# EasyEDA Pro project ProPrj_KrabbyUno - v0.2_2026-05-19.epro, board PCB2
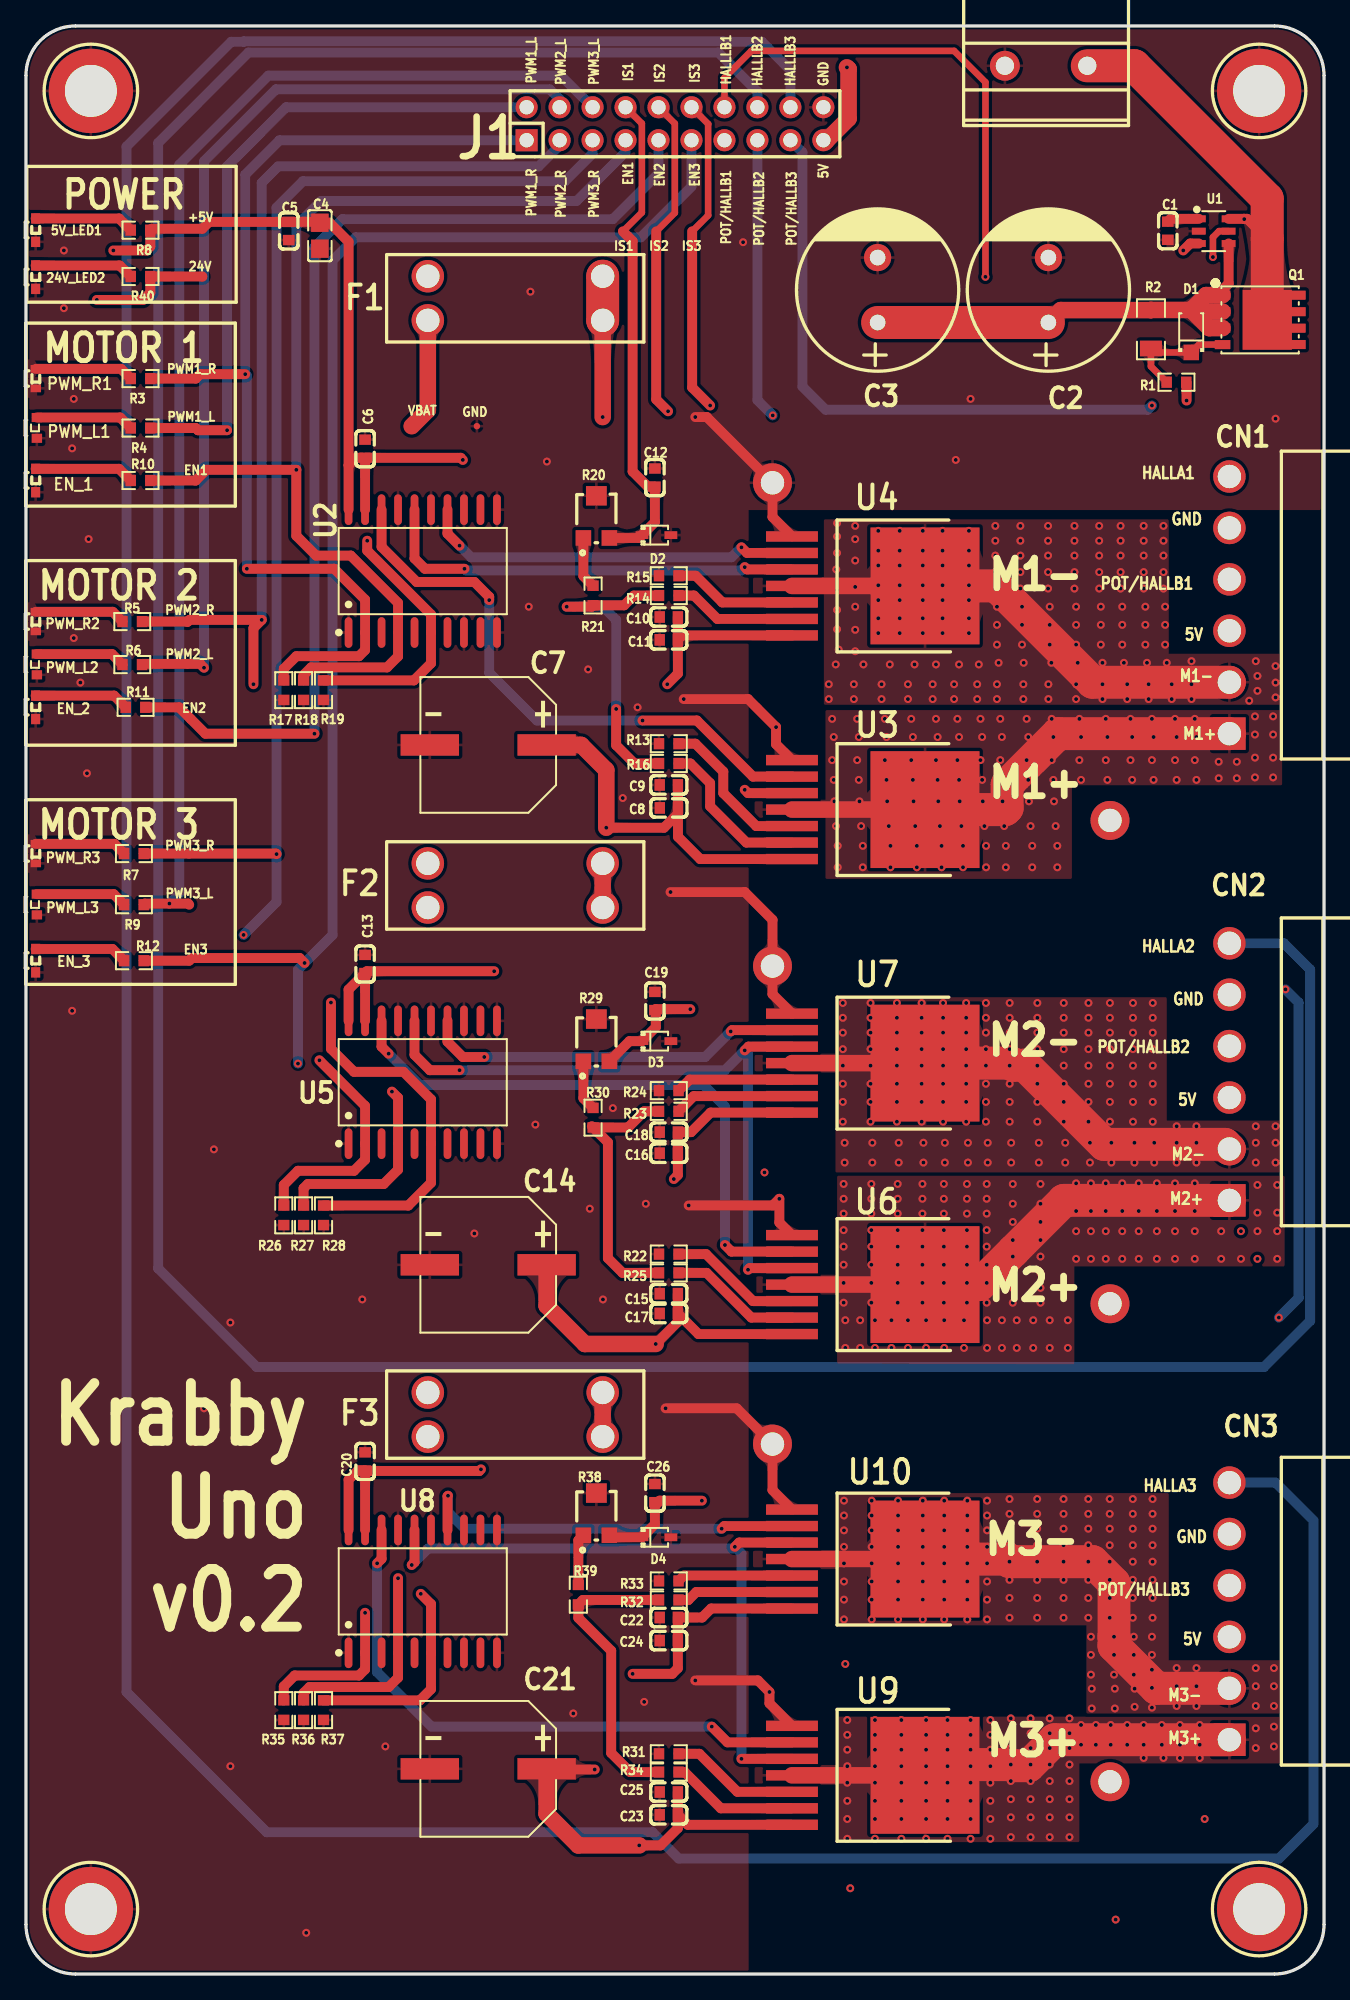
[diagram p8: board, top side]
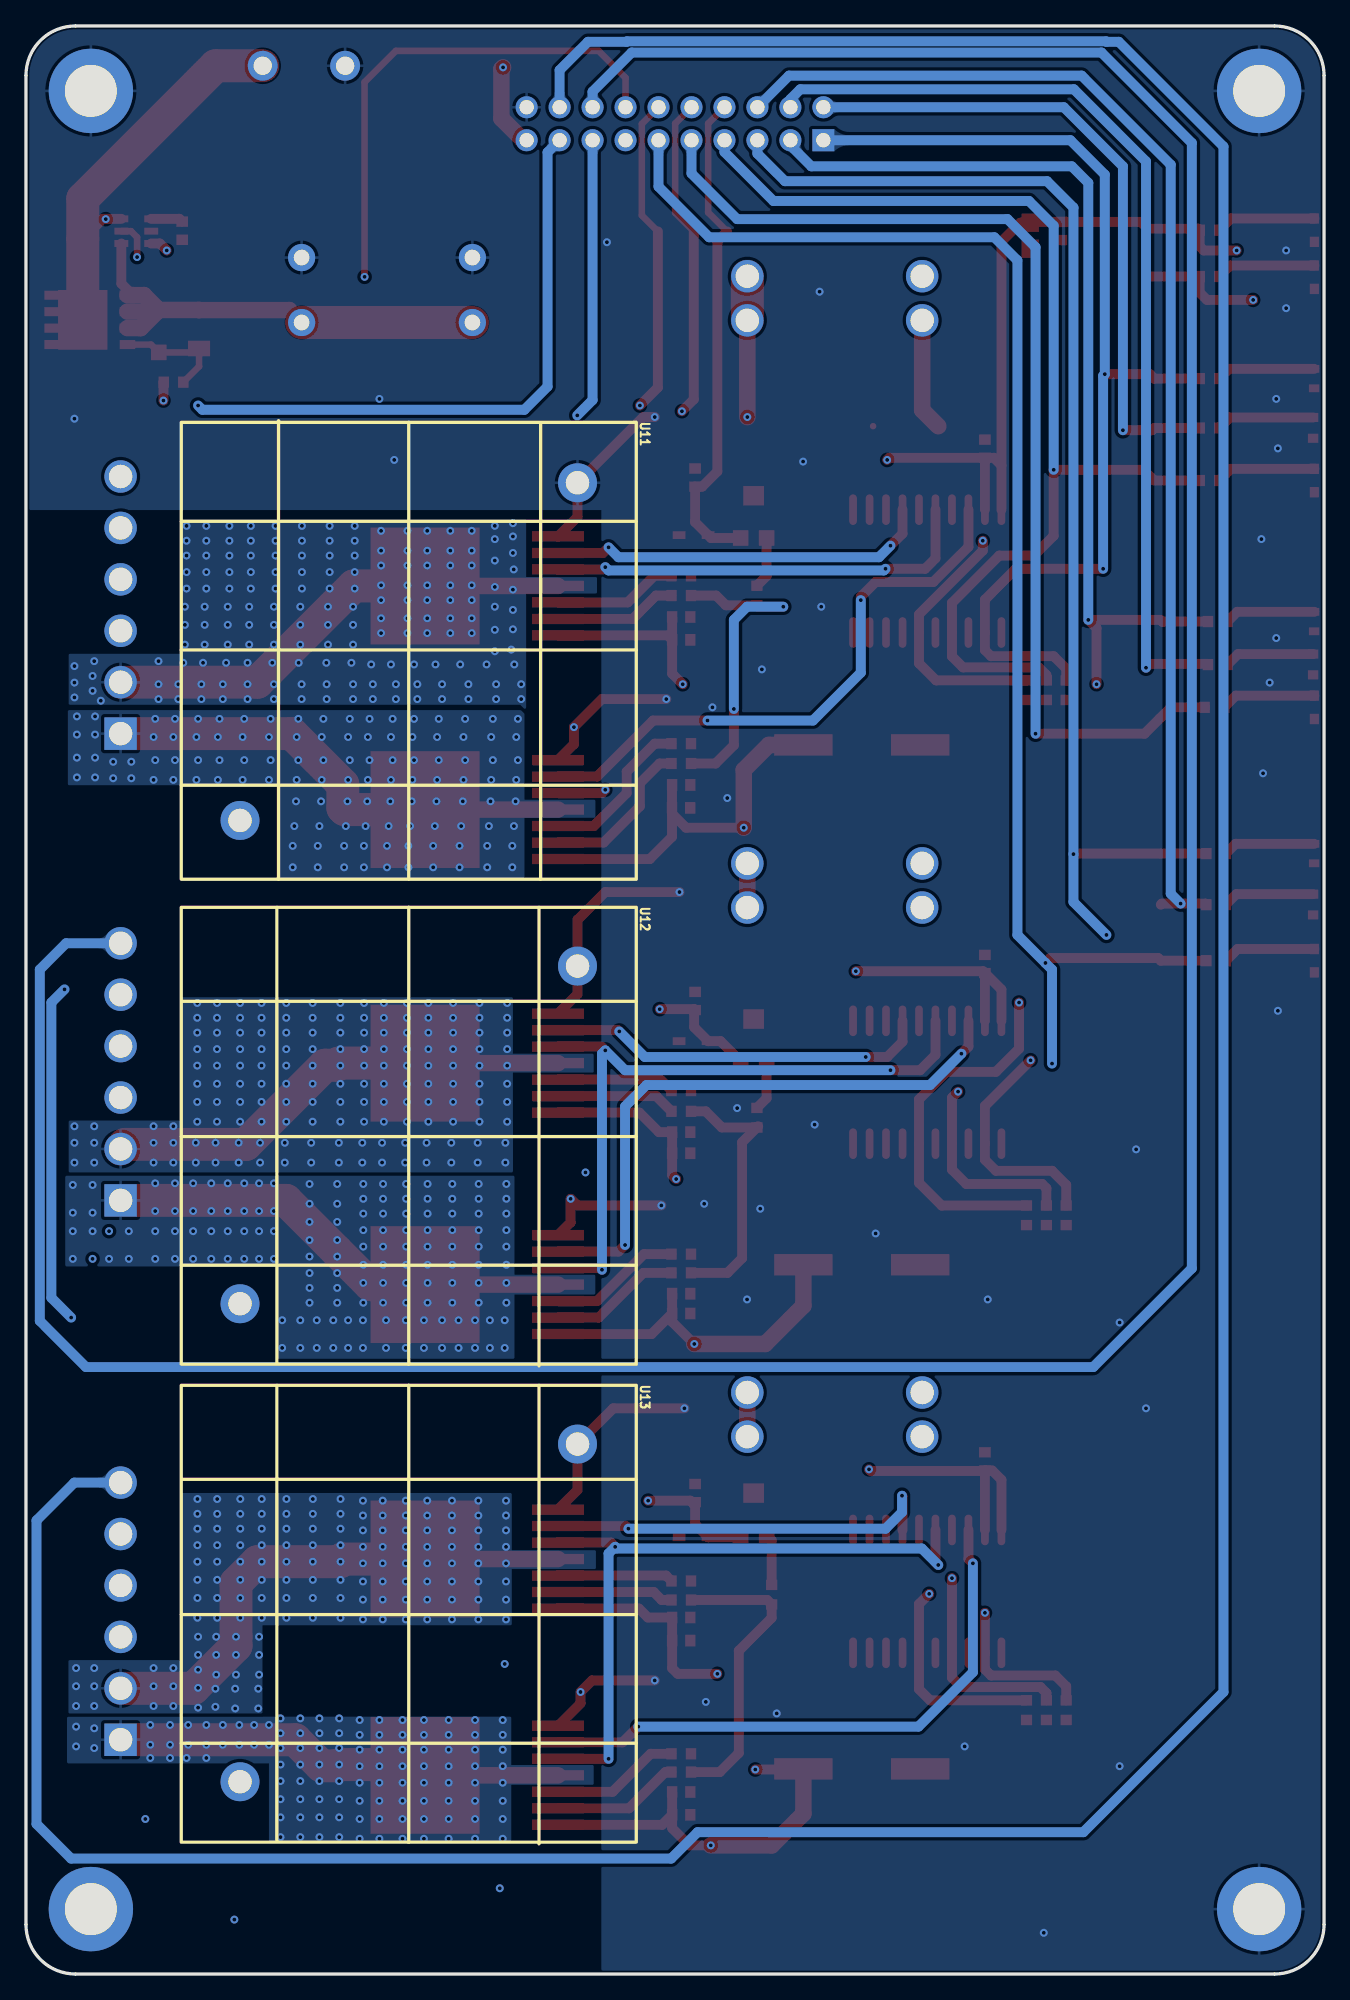
[diagram p9: board, bottom side, seen from below]

Outline 100 x 150 mm; copper layers: Top Layer, Inner1, Inner2, Bottom Layer. Coordinates in mm from the lower left corner of the outline.
Outline path: 0,146.19 0,3.81 arc(1.12,1.12) 3.81,0 96.19,0 arc(98.88,1.12) 100,3.81 100,146.19 arc(98.88,148.88) 96.19,150 3.81,150 arc(1.12,148.88) 0,146.19
Stack: Top Layer 0.035mm Outer layer thickness 1oz / Dielectric1 0.2104mm 7628 RC49% 8.6mil / Inner1 0.0152mm Inner layer thickness / Dielectric2 1.065mm 1.1mm H/HOZ Copper / Inner2 0.0152mm Inner layer thickness / Dielectric3 0.2104mm 7628 RC49% 8.6mil / Bottom Layer 0.035mm Outer layer thickness 1oz

## Design rules (mm)
template: Custom Config
spacing copperThickness1oz (default): track to track 0.102, other pairs 0.152 to 0.3
spacing copperThickness2oz: track to track 0.203, other pairs 0.152 to 0.3
track width copperThickness1oz (default): min 0.127, default 0.762, max 3.81
track width copperThickness2oz: min 0.203, default 0.254, max 2.54
differential pair differentialPair (default): width min 0.127, default 0.254, max 2.54; gap min 0.152, default 0.152
via viaSize (default): diameter min 0.5, default 0.61, max 10; hole min 0.3, default 0.305, max 6.3

## Placement (name value [footprint] x y rotation side)
5V_LED1  LTST-S270TGKT  [LED-SMD_L1.7-W0.6-RD_GREEN]  0.75 134.28 90 top
24V  -  [Test-Point-0.5mm]  13.59 130.7 0 top
24V_LED2  LTST-S270TGKT  [LED-SMD_L1.7-W0.6-RD_GREEN]  0.75 130.66 90 top
+5V  -  [Test-Point-0.5mm]  13.59 134.39 270 top
C1  100nF  [C0603]  87.97 134.24 90 top
C2  1000uF  [CAP-TH_BD12.5-P5.00-D0.6-FD]  78.77 129.67 90 top
C3  1000uF  [CAP-TH_BD12.5-P5.00-D0.6-FD]  65.61 129.67 90 top
C4  4.7uF  [C0805]  22.64 133.85 90 top
C5  100nF  [C0603]  20.24 134.21 270 top
C6  100nF  [C0603]  26.12 117.45 270 top
C7  330uF  [CAP-SMD_BD10.0-L10.3-W10.3-LS11.0-FD]  35.61 94.64 180 top
C8  100nF  [C0603]  49.53 89.79 180 top
C9  1uF  [C0603]  49.52 91.56 180 top
C10  100nF  [C0603]  49.52 104.49 180 top
C11  1uF  [C0603]  49.52 102.73 180 top
C12  100nF  [C0603]  48.45 115.23 90 top
C13  100nF  [C0603]  26.12 77.78 270 top
C14  330uF  [CAP-SMD_BD10.0-L10.3-W10.3-LS11.0-FD]  35.61 54.61 180 top
C15  100nF  [C0603]  49.52 52.39 180 top
C16  1uF  [C0603]  49.52 63.2 180 top
C17  100nF  [C0603]  49.52 50.86 180 top
C18  1uF  [C0603]  49.52 64.83 180 top
C19  100nF  [C0603]  48.45 74.92 90 top
C20  100nF  [C0603]  26.12 39.47 270 top
C21  330uF  [CAP-SMD_BD10.0-L10.3-W10.3-LS11.0-FD]  35.61 15.8 180 top
C22  100nF  [C0603]  49.52 27.45 180 top
C23  1uF  [C0603]  49.52 12.26 180 top
C24  100nF  [C0603]  49.52 25.68 180 top
C25  1uF  [C0603]  49.52 14.02 180 top
C26  100nF  [C0603]  48.45 37.03 90 top
CN1  B6PS-VH(LF)(SN)  [CONN-TH_B6PS-VH-LF-SN]  92.71 105.41 90 top
CN2  B6PS-VH(LF)(SN)  [CONN-TH_B6PS-VH-LF-SN]  92.71 69.47 90 top
CN3  B6PS-VH(LF)(SN)  [CONN-TH_B6PS-VH-LF-SN]  92.71 27.94 90 top
D1  KDZVTR12B  [SOD-123FL_L2.7-W1.8-LS3.8-RD]  89.77 126.5 90 top
D2  BZT52C5V1S  [SOD-323_L1.7-W1.3-LS2.5-RD-1]  48.56 110.8 0 top
D3  BZT52C5V1S  [SOD-323_L1.7-W1.3-LS2.5-RD-1]  48.56 71.83 0 top
D4  BZT52C5V1S  [SOD-323_L1.7-W1.3-LS2.5-RD-1]  48.56 33.63 0 top
EN1  -  [Test-Point-0.5mm]  13.08 115 0 top
EN2  -  [Test-Point-0.5mm]  12.7 96.63 0 top
EN3  -  [Test-Point-0.5mm]  12.57 78.03 0 top
EN_1  LTST-S270TGKT  [LED-SMD_L1.7-W0.6-RD_GREEN]  0.75 115 90 top
EN_2  LTST-S270TGKT  [LED-SMD_L1.7-W0.6-RD_GREEN]  0.75 97.54 90 top
EN_3  LTST-S270TGKT  [LED-SMD_L1.7-W0.6-RD_GREEN]  0.75 78.03 90 top
F1  3557-2  [FUSE-TH_4P-L19.8-W6.7_3557-2]  37.69 129.03 0 top
F2  3557-2  [FUSE-TH_4P-L19.8-W6.7_3557-2]  37.69 83.82 0 top
F3  3557-2  [FUSE-TH_4P-L19.8-W6.7_3557-2]  37.69 43.08 0 top
GND  -  [Test-Point-0.5mm]  34.74 119.18 0 top
IS1  -  [Test-Point-0.5mm]  45.99 134.18 0 top
IS2  -  [Test-Point-0.5mm]  48.55 134.18 270 top
IS3  -  [Test-Point-0.5mm]  51.32 134.18 270 top
J1  PZ254V-12-20P  [HDR-TH_20P-P2.54-V-M-R2-C10-S2.54]  50 142.47 0 top
M1  SMTSO2025CTJ  [SMD-1_BD6.2-D3.6]  5 5 0 top
M1+  -  [Test-Point-0.5mm]  75.59 89.8 0 top
M1-  -  [Test-Point-0.5mm]  75.59 106.05 90 top
M2  SMTSO2025CTJ  [SMD-1_BD6.2-D3.6]  95 5 0 top
M2+  -  [Test-Point-0.5mm]  76.07 55.68 270 top
M2-  -  [Test-Point-0.5mm]  76.07 69.98 180 top
M3  SMTSO2025CTJ  [SMD-1_BD6.2-D3.6]  5 145 0 top
M3+  -  [Test-Point-0.5mm]  75.95 16.03 0 top
M3-  -  [Test-Point-0.5mm]  75.95 31.65 0 top
M4  SMTSO2025CTJ  [SMD-1_BD6.2-D3.6]  95 145 0 top
PWM1_L  -  [Test-Point-0.5mm]  13.08 119.04 0 top
PWM1_R  -  [Test-Point-0.5mm]  13.08 122.85 0 top
PWM2_L  -  [Test-Point-0.5mm]  12.45 100.88 270 top
PWM2_R  -  [Test-Point-0.5mm]  12.45 104.12 0 top
PWM3_L  -  [Test-Point-0.5mm]  12.57 82.34 180 top
PWM3_R  -  [Test-Point-0.5mm]  12.57 86.28 270 top
PWM_L1  XL-1606UBC  [LED-SMD_L1.7-W1.1-R-RD_BULE]  0.84 119.05 90 top
PWM_L2  XL-1606UBC  [LED-SMD_L1.7-W1.1-R-RD_BULE]  0.84 100.84 90 top
PWM_L3  XL-1606UBC  [LED-SMD_L1.7-W1.1-R-RD_BULE]  0.84 82.35 90 top
PWM_R1  XL-1606UYC  [LED-SMD_L1.7-W1.1-RD_27-21]  0.76 122.85 90 top
PWM_R2  XL-1606UYC  [LED-SMD_L1.7-W1.1-RD_27-21]  0.76 104.14 90 top
PWM_R3  XL-1606UYC  [LED-SMD_L1.7-W1.1-RD_27-21]  0.76 86.28 90 top
PWR_IN1  1714955  [CONN-TH_P6.35_1714955]  78.59 146.94 180 top
Q1  CJAC130SN06L  [PDFN-8_L5.8-W5.0-P1.27-LS6.0-BL]  95.08 127.37 270 top
R1  22R  [R0603]  88.63 122.57 180 top
R2  100kΩ  [R1206]  86.66 126.64 270 top
R3  4.7K  [R0603]  8.83 122.85 180 top
R4  4.7K  [R0603]  8.83 119.04 180 top
R5  4.7K  [R0603]  8.19 104.14 180 top
R6  4.7K  [R0603]  8.19 100.83 180 top
R7  4.7K  [R0603]  8.32 86.28 180 top
R8  4.7K  [R0603]  8.83 134.28 180 top
R9  4.7K  [R0603]  8.32 82.34 180 top
R10  4.7K  [R0603]  8.83 115 180 top
R11  4.7K  [R0603]  8.44 97.54 180 top
R12  4.7K  [R0603]  8.32 78.03 180 top
R13  1K  [R0603]  49.52 94.73 180 top
R14  1K  [R0603]  49.52 106.14 0 top
R15  1K  [R0603]  49.52 107.67 0 top
R16  1K  [R0603]  49.52 93.21 0 top
R17  10K  [R0603]  19.86 98.86 90 top
R18  10K  [R0603]  21.39 98.86 90 top
R19  10K  [R0603]  22.92 98.86 90 top
R20  10kΩ  [RES-ADJ-SMD_3P-L3.0-W3.8-P1.75-BR]  43.94 112.2 270 top
R21  4.7K  [R0603]  43.69 106.15 90 top
R22  1K  [R0603]  49.52 55.43 180 top
R23  1K  [R0603]  49.52 66.43 0 top
R24  1K  [R0603]  49.52 68.02 0 top
R25  1K  [R0603]  49.52 53.99 0 top
R26  10K  [R0603]  19.86 58.42 90 top
R27  10K  [R0603]  21.39 58.42 90 top
R28  10K  [R0603]  22.92 58.42 90 top
R29  10kΩ  [RES-ADJ-SMD_3P-L3.0-W3.8-P1.75-BR]  43.94 71.91 270 top
R30  4.7K  [R0603]  43.69 65.94 90 top
R31  1K  [R0603]  49.52 16.96 180 top
R32  1K  [R0603]  49.52 28.8 0 top
R33  1K  [R0603]  49.52 30.27 0 top
R34  1K  [R0603]  49.52 15.55 0 top
R35  10K  [R0603]  19.86 20.32 90 top
R36  10K  [R0603]  21.39 20.32 90 top
R37  10K  [R0603]  22.92 20.32 90 top
R38  10kΩ  [RES-ADJ-SMD_3P-L3.0-W3.8-P1.75-BR]  43.94 35.41 270 top
R39  4.7K  [R0603]  42.55 29.21 90 top
R40  4.7K  [R0603]  8.83 130.71 180 top
U1  LM74700QDBVRQ1  [SOT-23-6_L2.9-W1.6-P0.95-LS2.8-BL]  91.5 134.2 270 top
U2  SN74AHC244DWR  [SOIC-20_L13.0-W7.6-P1.27-LS10.3-BL]  30.57 108.03 0 top
U3  BTN8982TA  [TO-263-7_L10.2-W10.4-P1.27-LS14.4-TL]  64.13 89.66 0 top
U4  BTN8982TA  [TO-263-7_L10.2-W10.4-P1.27-LS14.4-TL]  64.13 106.88 0 top
U5  SN74AHC244DWR  [SOIC-20_L13.0-W7.6-P1.27-LS10.3-BL]  30.57 68.67 0 top
U6  BTN8982TA  [TO-263-7_L10.2-W10.4-P1.27-LS14.4-TL]  64.13 53.09 0 top
U7  BTN8982TA  [TO-263-7_L10.2-W10.4-P1.27-LS14.4-TL]  64.13 70.14 0 top
U8  SN74AHC244DWR  [SOIC-20_L13.0-W7.6-P1.27-LS10.3-BL]  30.57 29.46 0 top
U9  BTN8982TA  [TO-263-7_L10.2-W10.4-P1.27-LS14.4-TL]  64.13 15.3 0 top
U10  BTN8982TA  [TO-263-7_L10.2-W10.4-P1.27-LS14.4-TL]  64.13 31.95 0 top
U11  XSD188-663  [HEATSINK-SMD_XSD188-663]  70.51 101.83 90 bottom
U12  XSD188-663  [HEATSINK-SMD_XSD188-663]  70.51 64.61 270 bottom
U13  XSD188-663  [HEATSINK-SMD_XSD188-663]  70.51 27.81 270 bottom
VBAT  -  [Test-Point-0.5mm]  29.72 119.18 270 top

## Footprints (pads in the part's own frame, mm; a bottom-side part is the same pattern mirrored in y, then rotated)
C0603
  rect 0.8x0.9 smd: 1(-0.7,0) 2(0.7,0)
C0805
  rect 1.41x1.35 smd: 1(-1,0) 2(1,0)
CAP-SMD_BD10.0-L10.3-W10.3-LS11.0-FD
  rect 4.5x1.65 smd: 1(-4.5,0) 2(4.5,0)
CAP-TH_BD12.5-P5.00-D0.6-FD
  round 2.1 hole 1.2: 1(-2.5,0) 2(2.5,0)
CONN-TH_B6PS-VH-LF-SN
  rect 2.5x2.5 hole 1.8: 1(-9.9,0)
  round 2.5 hole 1.8: 2(-5.94,0) 3(-1.98,0) 4(1.98,0) 5(5.94,0) 6(9.9,0)
CONN-TH_P6.35_1714955
  round 2.3 hole 1.4: 1(-3.175,0) 2(3.175,0)
FUSE-TH_4P-L19.8-W6.7_3557-2
  round 2.5 hole 1.8: 1(-6.735,1.7) 2(-6.735,-1.7) 3(6.735,1.7) 4(6.735,-1.7)
HDR-TH_20P-P2.54-V-M-R2-C10-S2.54
  rect 1.7x1.7 hole 1.1: 1(-11.43,-1.27)
  round 1.7 hole 1.1: 2(-11.43,1.27) 3(-8.89,-1.27) 4(-8.89,1.27) 5(-6.35,-1.27) 6(-6.35,1.27) 7(-3.81,-1.27) 8(-3.81,1.27) 9(-1.27,-1.27) 10(-1.27,1.27) 11(1.27,-1.27) 12(1.27,1.27) 13(3.81,-1.27) 14(3.81,1.27) 15(6.35,-1.27) 16(6.35,1.27) 17(8.89,-1.27) 18(8.89,1.27) 19(11.43,-1.27) 20(11.43,1.27)
HEATSINK-SMD_XSD188-663
  round 3 hole 1.8: 1(-13,13) 2(13,-13)
LED-SMD_L1.7-W0.6-RD_GREEN
  rect 0.8x0.7 smd: 1(-0.9,0) 2(0.9,0)
LED-SMD_L1.7-W1.1-R-RD_BULE
  rect 0.7x0.8 smd: 1(0.8,0) 2(-0.8,0)
LED-SMD_L1.7-W1.1-RD_27-21
  rect 0.6x0.8 smd: 1(-0.75,0) 2(0.75,0)
PDFN-8_L5.8-W5.0-P1.27-LS6.0-BL
  rect 0.7x1.2 smd: 1(-1.905,-2.9) 2(-0.635,-2.9) 3(0.635,-2.9) 4(1.905,-2.9) 5(1.9,2.9) 6(0.64,2.9) 7(-0.63,2.9) 8(-1.9,2.9)
  rect 4.6x3.8 smd: 9(0,0.54)
R0603
  rect 0.806x0.864 smd: 1(-0.753,0) 2(0.753,0)
R1206
  rect 1.208x1.701 smd: 1(-1.479,0) 2(1.479,0)
RES-ADJ-SMD_3P-L3.0-W3.8-P1.75-BR
  rect 1.2x1.2 smd: 1(1.625,-1) 3(1.625,1)
  rect 1.5x1.6 smd: 2(-1.625,0)
SMD-1_BD6.2-D3.6
  round 6.5 hole 4: 1(0,0)
SOD-123FL_L2.7-W1.8-LS3.8-RD
  rect 1.2x1.2 smd: 1(-1.635,0) 2(1.635,0)
SOD-323_L1.7-W1.3-LS2.5-RD-1
  rect 0.985x0.6 smd: 1(-1.117,0) 2(1.117,0)
SOIC-20_L13.0-W7.6-P1.27-LS10.3-BL
  oval 0.595x2.36 smd: 1(-5.715,-4.73) 2(-4.445,-4.73) 3(-3.175,-4.73) 4(-1.905,-4.73) 5(-0.635,-4.73) 6(0.635,-4.73) 7(1.905,-4.73) 8(3.175,-4.73) 9(4.445,-4.73) 10(5.715,-4.73) 11(5.715,4.73) 12(4.445,4.73) 13(3.175,4.73) 14(1.905,4.73) 15(0.635,4.73) 16(-0.635,4.73) 17(-1.905,4.73) 18(-3.175,4.73) 19(-4.445,4.73) 20(-5.715,4.73)
SOT-23-6_L2.9-W1.6-P0.95-LS2.8-BL
  rect 0.532x1.072 smd: 1(-0.95,-1.149) 2(0,-1.149) 3(0.95,-1.149) 4(0.95,1.149) 5(0,1.149) 6(-0.95,1.149)
Test-Point-0.5mm
  round 0.5 smd: 1(0,0)
TO-263-7_L10.2-W10.4-P1.27-LS14.4-TL
  rect 4x0.8 smd: 1(-5.122,3.81) 2(-5.122,2.54) 3(-5.122,1.27) 4(-5.122,0) 5(-5.122,-1.27) 6(-5.122,-2.54) 7(-5.122,-3.81)
  rect 8.4x9 smd: 8(5.122,0)

## Nets
As in the schematic.

Pads without a net: U2 3 5 7 9 12; U5 3 5 7 9 12; U8 3 5 7 9 12

## Via types
v1: diameter 0.61, hole 0.305, Top Layer to Bottom Layer, 955 vias

## Routing (per net, layer and track width the routed paths; a pad name or vN(x,y) marks a point on that pad's centre or on a via; arc(x,y) is an arc through that point)
+5V: length 370.4
  Top Layer w0.762: U2.19 26.12,116.52 25.9,116.75 25.44,116.75 24.85,116.17 ; C6.2 33.49,116.75 v1(33.66,116.59) ; U5.19 C13.2 ; C13.2 24.85,75.81 U5.20 ; C13.2 26.26,77.22 v1(36.07,77.22) ; C20.2 26.16,38.74 34.93,38.74 v1(35.05,38.86) ; C20.2 U8.19 ; C20.2 25.56,38.77 24.85,38.06 U8.20 ; v1(6.73,132.72) 9.27,132.72 9.58,133.02 R8.1 9.69,134.39 +5V.1 14.11,134.91 C5.1 22.58,134.91 C4.2 23.39,134.85 24.85,133.39 24.85,116.17 ; 24.85,116.17 U2.20
  Top Layer w1.27: J1.19 61.7,141.2 63.37,142.88 63.37,146.69 v1(63.25,146.81)
  Inner2 w0.762: v1(33.66,116.59) 35.18,116.59 36.96,114.81 36.96,78.11 ; 36.96,78.11 v1(36.07,77.22) ; 36.96,78.11 36.96,40.77 v1(35.05,38.86)
  Inner2 w1.016: v1(63.25,146.81) 62.24,147.82 15.72,147.82 6.73,138.83 v1(6.73,132.72)
  Inner2 w1.27: CN3.3 96.95,25.96 98.81,27.81 98.81,65.79 97.1,67.49 CN2.3 ; CN1.3 95.43,103.43 97.03,105.03 97.03,115.7 94.11,118.62 86.11,118.62 84.2,120.52 84.2,138.68 81.68,141.2 J1.19
GND: length 75.3
  Top Layer w0.762: U9.1 57.28,20.85 v1(57.28,21.72) 56.39,22.61 v1(51.56,22.61) ; v1(49.28,43.56) 54.76,43.56 U13.1 57.51,37.26 U10.1 ; U3.1 57.78,94.7 v1(57.78,96.01) 55.63,98.17 v1(50.67,98.17) ; U6.1 58.04,57.87 v1(58.04,59.69) 57.53,59.18 v1(51.05,59.18) ; U7.1 57.51,75.45 U12.1 57.51,81.17 55.37,83.31 v1(49.66,83.31) ; U4.1 57.51,112.19 U11.2 52.45,119.89 v1(51.56,119.89)
  vias: v1(2.92,132.72) v1(2.92,128.27) v1(3.56,117.47) v1(3.56,74.17) v1(3.68,121.28) v1(3.68,102.87) v1(4.19,99.44) v1(4.7,92.46) v1(4.83,110.49) v1(13.72,43.56) v1(14.48,63.5) v1(15.75,50.16) v1(15.75,16) v1(21.59,3.18) v1(25.91,51.94) v1(27.69,17.53) v1(34.54,57.02) v1(38.74,105.28) v1(38.86,129.54) v1(39.24,65.41) v1(40.13,116.46) v1(42.16,20.07) v1(43.31,100.46) v1(43.43,58.93) v1(44.45,51.94) v1(45.21,66.67) v1(45.97,90.55) v1(47.12,97.54) v1(47.62,20.96) v1(47.75,59.31) v1(55.25,133.35) v1(56.9,61.72) v1(63.12,23.88) v1(63.5,6.6) v1(71.63,116.59) v1(72.77,121.28) v1(83.95,4.19) v1(90.81,11.94) v1(93.6,57.2) v1(94.87,55.07) v1(96.27,119.76)
VBAT: length 172.7
  Top Layer w0.762: 91.76,129.28 92.65,130.16 U1.4
  Top Layer w1.27: Q1.1 90.91,129.28 D1.2 86.68,128.13 R2.1 79.72,128.12 C2.1 ; F1.2 30.96,120.42 VBAT.1 ; Q1.3 91.17,126.74 89.9,128.01 Q1.2
  Top Layer w2.54: C3.1 C2.1
  Inner2 w2.54: F3.2 F3.1 F2.2 F2.1 F1.2 ; F1.2 F1.1 ; F1.2 34.85,123.44 61.88,123.44 C3.1
VBAT_FUSED: length 140.5
  Top Layer w0.762: 93.83,135.15 94.07,135.15 95.62,133.59 ; 93.83,135.15 U1.6 ; 93.83,135.15 v1(93.85,135.13) ; v1(5.46,128.91) 9.02,128.91 9.58,129.47 R40.1 13.58,130.71 24V.1 ; v1(89.15,132.72) 89.69,133.25 U1.3
  Top Layer w2.54: Q1.9 95.62,136.7 85.38,146.94 PWR_IN1.1
  Inner2 w0.762: v1(93.85,135.13) 89.79,135.13 89.15,134.49 v1(89.15,132.72)
  Inner2 w1.27: PWR_IN1.1 79.63,149.06 15.21,149.06 5.46,139.32 v1(5.46,128.91)
VBAT_M1: length 94.3
  Top Layer w0.762: C11.1 50.56,103.07 U4.7 ; C11.1 C10.1 ; C11.1 50.22,100.13 v1(49.4,99.31) ; C9.1 50.23,91.55 C8.1 50.23,89.35 ; 50.23,89.35 49.15,88.27 v1(44.7,88.27) ; 50.23,89.35 50.23,87.56 51.94,85.85 U3.7
  Top Layer w1.27: v1(44.7,88.27) 44.7,92.71 42.77,94.64 C7.1 ; F1.4 v1(44.43,119.89)
  Top Layer w2.54: F1.3 F1.4
  Inner2 w1.27: v1(44.7,88.27) 48.13,88.27 49.4,89.53 v1(49.4,99.31) 50.42,100.33 50.42,115.95 46.48,119.89 v1(44.43,119.89)
VBAT_M2: length 81.9
  Top Layer w0.762: C17.1 C15.1 ; C17.1 50.22,50.22 v1(48.51,48.51) ; C17.1 51.81,49.28 U6.7 ; v1(49.91,61.21) 50.22,61.52 C16.1 C18.1 51.24,64.83 52.74,66.33 U7.7
  Top Layer w1.27: C14.1 40.11,51.46 43.05,48.51 v1(48.51,48.51) ; F2.3 F2.4
  Inner2 w1.27: v1(48.51,48.51) 49.91,49.91 v1(49.91,61.21) 49.91,80.14 47.93,82.12 F2.4
VBAT_M3: length 98.8
  Top Layer w0.762: C23.1 C25.1 ; C23.1 50.99,11.49 U9.7 ; C23.1 50.22,11.23 48.9,9.91 v1(47.24,9.91) ; C21.1 40.16,15.75 v1(43.81,15.75) ; v1(46.74,23.11) 49.78,23.11 50.22,23.55 C24.1 C22.1 52.09,27.45 52.78,28.14 U10.7
  Top Layer w1.27: F3.3 F3.4 ; C21.1 40.11,12.34 42.54,9.91 v1(47.24,9.91)
  Inner2 w0.762: v1(43.81,15.75) 45.97,15.75 46.74,16.51 v1(46.74,23.11)
  Inner2 w1.27: F3.4 48.41,41.38 49.91,39.88 49.91,10.92 48.9,9.91 v1(47.24,9.91)
EN1: length 86.5
  Top Layer w0.762: R10.1 EN1.1 13.91,115.82 v1(20.83,115.82) 20.83,110.74 22.35,109.22 25.02,109.22 28.66,105.58 U2.4 28.66,101.46 27.81,100.61 21.97,100.61 21.39,100.03 R18.2
  Bottom Layer w0.762: J1.7 46.19,140.3 42.42,136.53 22.73,136.53 20.83,134.62 v1(20.83,115.82)
EN1_BUF: length 54.3
  Top Layer w0.762: v1(33.78,108.2) 30.73,108.2 29.93,109 U2.16 ; v1(55.37,108.33) 55.55,108.15 U4.3 ; U3.3 55.63,90.93 v1(55.37,91.19)
  Inner2 w0.762: v1(55.37,108.33) v1(55.37,91.19)
  Bottom Layer w0.762: v1(33.78,108.2) 33.91,108.08 55.12,108.08 v1(55.37,108.33)
EN2: length 128.2
  Top Layer w0.762: 9.2,97.54 11.8,97.54 EN2.1 13.83,95.5 v1(22.22,95.5) ; v1(28.19,67.94) 28.66,67.48 U5.4 28.66,61.94 27.56,60.83 21.72,60.83 21.39,60.5 R27.2
  Inner2 w0.762: v1(28.19,67.94) 22.63,73.51 22.63,95.1 v1(22.22,95.5)
  Bottom Layer w0.762: J1.9 48.73,138.65 45.21,135.13 24.38,135.13 22.22,132.97 v1(22.22,95.5)
EN2_BUF: length 53.4
  Top Layer w0.762: v1(33.4,69.6) 31.12,69.6 29.93,70.78 U5.16 ; v1(55.63,54.23) 55.75,54.36 U6.3 ; U7.3 55.66,71.41 v1(55.37,71.12)
  Bottom Layer w0.762: v1(55.63,54.23) 55.63,70.87 v1(55.37,71.12) 53.85,69.6 v1(33.4,69.6)
EN3: length 170.3
  Top Layer w0.762: R12.1 EN3.1 12.78,78.23 21.08,78.23 v1(21.46,77.85) ; R36.2 21.39,21.64 21.84,22.1 27.94,22.1 28.66,22.82 U8.4 v1(28.66,30.48)
  Inner2 w0.762: v1(28.66,30.48) 24.64,30.48 20.95,34.16 v1(20.95,70.1)
  Bottom Layer w0.762: J1.11 51.27,137.63 47.37,133.73 25.4,133.73 23.62,131.95 23.62,80.01 v1(21.46,77.85) 20.95,77.34 v1(20.95,70.1)
EN3_BUF: length 53.2
  Top Layer w0.762: U9.3 v1(55.12,16.57) ; U10.3 54.94,33.22 v1(54.61,32.89) ; U8.16 29.93,31.71 v1(29.72,31.5)
  Bottom Layer w0.762: v1(29.72,31.5) 30.99,32.77 54.48,32.77 v1(54.61,32.89) 55.12,32.38 v1(55.12,16.57)
HALLA1: length 70.4
  Top Layer w0.508: J1.14 53.81,146.01 55.88,148.08 71.5,148.08 73.91,145.67 v1(73.91,130.68)
  Inner2 w0.762: v1(73.91,130.68) 73.91,120.4 79,115.31 CN1.6
HALLA2: length 265.6
  Bottom Layer w0.762: J1.16 56.35,144.94 53.34,147.95 17.14,147.95 10.19,141 10.19,54.33 17.78,46.74 95.38,46.74 98.93,50.29 98.93,77.34 96.91,79.37 CN2.6
HALLA3: length 306.2
  Bottom Layer w0.762: J1.18 58.89,146.6 56.71,148.78 53.74,148.78 53.7,148.82 16.79,148.82 16.75,148.78 15.81,148.78 7.75,140.72 7.75,21.72 18.54,10.92 48.26,10.92 50.29,8.89 96.52,8.89 99.19,11.56 99.19,34.93 96.27,37.84 CN3.6
IS1: length 38.4
  Top Layer w0.508: J1.8 47.45,142.49 47.45,135.64 IS1.1
  Top Layer w0.762: R20.3 47.23,110.57 D2.1 48.45,111.8 C12.1 47.91,114.53 46.74,115.7 46.74,133.43 IS1.1
IS1_RAW: length 25.2
  Top Layer w0.762: R16.1 46.87,93.21 45.47,94.61 v1(45.47,97.41) ; v1(41.66,105.28) 43.58,105.28 R21.1 46.08,105.39 46.83,106.14 R14.1
  Bottom Layer w0.762: v1(45.47,97.41) 45.47,104.27 44.45,105.28 v1(41.66,105.28)
IS2: length 81
  Top Layer w0.508: J1.10 49.99,142.49 49.99,135.61 IS2.1
  Top Layer w0.762: 48.52,74.3 C19.1 ; 48.52,74.3 v1(51.18,74.3) ; 48.52,74.3 48.52,72.91 D3.1 46.49,71.83 R29.3 ; IS2.1 48.55,121.25 v1(49.47,120.33)
  Inner2 w0.762: v1(51.18,74.3) 51.82,74.93 51.82,117.98 v1(49.47,120.33)
IS2_RAW: length 20.7
  Top Layer w0.762: R30.1 46.39,65.19 47.63,66.43 R23.1 ; R30.1 44.83,64.04 44.83,55.12 45.96,53.99 R25.1 ; R30.1 43.59,65.28
IS3: length 119.5
  Top Layer w0.508: IS3.1 52.55,135.41 52.55,142.46 J1.12
  Top Layer w0.762: IS3.1 51.32,122.16 v1(52.71,120.78) ; R38.3 45.09,33.63 D4.1 48.45,34.64 48.45,36.09 ; 48.45,36.09 C26.1 ; 48.45,36.09 48.81,36.45 v1(52.07,36.45)
  Inner2 w0.762: v1(52.71,120.78) 53.72,119.76 53.72,74.8 52.07,73.15 v1(52.07,36.45)
IS3_RAW: length 23.1
  Top Layer w0.762: R32.1 42.9,28.8 R39.1 42.55,27.42 45.09,24.89 45.09,17.02 46.55,15.55 R34.1
M1+: length 37.2
  Top Layer w1.27: U3.4 U3.8
  Top Layer w2.54: CN1.1 79.51,95.51 75.59,91.59 M1+.1 75.45,89.66 U3.8
  vias: v1(62.1,96.65) v1(62.1,93.47) v1(62.23,95.25) v1(62.23,91.95) v1(62.28,90.3) v1(62.41,88.39) v1(62.53,86.87) v1(62.53,85.22) v1(64.03,96.65) v1(64.03,93.47) v1(64.16,95.25) v1(64.16,91.95) v1(64.21,90.3) v1(64.34,88.39) v1(64.47,86.87) v1(64.47,85.22) v1(66.17,96.65) v1(66.17,93.47) v1(66.29,95.25) v1(66.29,91.95) v1(66.34,90.3) v1(66.47,88.39) v1(66.6,86.87) v1(66.6,85.22) v1(68.2,96.65) v1(68.2,93.47) v1(68.33,95.25) v1(68.33,91.95) v1(68.38,90.3) v1(68.5,88.39) v1(68.63,86.87) v1(68.63,85.22) v1(70.1,96.65) v1(70.1,93.47) v1(70.23,95.25) v1(70.23,91.95) v1(70.28,90.3) v1(70.41,88.39) v1(70.54,86.87) v1(70.54,85.22) v1(71.75,96.65) v1(71.75,93.47) v1(71.88,95.25) v1(71.88,91.95) v1(71.93,90.3) v1(72.06,88.39) v1(72.19,86.87) v1(72.19,85.22) v1(73.53,96.65) v1(73.53,93.47) v1(73.66,95.25) v1(73.66,91.95) v1(73.71,90.3) v1(73.84,88.39) v1(73.96,86.87) v1(73.96,85.22) v1(75.06,96.65) v1(75.06,93.47) v1(75.18,95.25) v1(75.18,91.95) v1(75.23,90.3) v1(75.36,88.39) v1(75.49,86.87) v1(75.49,85.22) v1(77.09,96.65) v1(77.09,93.47) v1(77.22,95.25) v1(77.22,91.95) v1(77.27,90.3) v1(77.39,88.39) v1(77.52,86.87) v1(77.52,85.22) v1(79.02,96.65) v1(79.02,93.47) v1(79.15,95.25) v1(79.15,91.95) v1(79.2,90.3) v1(79.32,88.39) v1(79.45,86.87) v1(79.45,85.22) v1(81.15,96.65) v1(81.15,93.47) v1(81.28,95.25) v1(81.28,91.95) v1(83.19,96.65) v1(83.19,93.47) v1(83.31,95.25) v1(83.31,91.95) v1(85.09,96.65) v1(85.09,93.47) v1(85.22,95.25) v1(85.22,91.95) v1(86.74,96.65) v1(86.74,93.47) v1(86.87,95.25) v1(86.87,91.95) v1(88.52,96.65) v1(88.52,93.47) v1(88.65,95.25) v1(88.65,91.95) v1(90.04,96.65) v1(90.04,93.47) v1(90.17,95.25) v1(90.17,91.95) v1(91.88,93.34) v1(91.88,92.08) v1(93.28,93.34) v1(93.28,92.08) v1(94.68,96.84) v1(94.68,95.44) v1(94.68,93.66) v1(94.68,92.14) v1(96.08,96.84) v1(96.08,95.44) v1(96.08,93.66) v1(96.08,92.14)
M1-: length 36.8
  Top Layer w1.27: U4.4 U4.8
  Top Layer w2.54: U4.8 74.75,106.88 M1-.1 82.17,99.47 CN1.2
  vias: v1(61.85,99.31) v1(61.85,98.17) v1(62.42,108.15) v1(62.38,100.84) v1(62.49,111.72) v1(62.49,110.69) v1(62.49,109.42) v1(62.49,106.6) v1(62.49,105.04) v1(62.49,103.54) v1(62.61,101.98) v1(63.78,99.31) v1(63.78,98.17) v1(63.88,111.51) v1(63.88,110.49) v1(63.88,108.84) v1(63.88,106.81) v1(63.88,105.28) v1(63.88,103.5) v1(63.88,101.85) v1(64.52,100.84) v1(65.66,111.12) v1(65.66,109.6) v1(65.66,108.46) v1(65.66,106.93) v1(65.66,105.79) v1(65.66,104.39) v1(65.66,103.25) v1(65.91,99.31) v1(65.91,98.17) v1(66.55,100.84) v1(67.31,111.12) v1(67.31,109.6) v1(67.31,108.46) v1(67.31,106.93) v1(67.31,105.79) v1(67.31,104.39) v1(67.31,103.25) v1(67.94,99.31) v1(67.94,98.17) v1(68.45,100.84) v1(69.09,111.12) v1(69.09,109.6) v1(69.09,108.46) v1(69.09,106.93) v1(69.09,105.79) v1(69.09,104.39) v1(69.09,103.25) v1(69.85,99.31) v1(69.85,98.17) v1(70.1,100.84) v1(70.61,111.12) v1(70.61,109.6) v1(70.61,108.46) v1(70.61,106.93) v1(70.61,105.79) v1(70.61,104.39) v1(70.61,103.25) v1(71.5,99.31) v1(71.5,98.17) v1(71.88,100.84) v1(72.64,111.12) v1(72.64,109.6) v1(72.64,108.46) v1(72.64,106.93) v1(72.64,105.79) v1(72.64,104.39) v1(72.64,103.25) v1(73.28,99.31) v1(73.28,98.17) v1(73.41,100.84) v1(74.68,111.51) v1(74.68,110.36) v1(74.68,109.22) v1(74.68,107.95) v1(74.68,106.68) v1(74.8,105.28) v1(74.8,103.89) v1(74.8,102.36) v1(74.8,99.31) v1(74.8,98.17) v1(74.93,100.97) v1(76.61,111.51) v1(76.61,110.36) v1(76.61,109.22) v1(76.61,107.95) v1(76.61,106.68) v1(76.73,105.28) v1(76.73,103.89) v1(76.73,102.36) v1(76.84,99.31) v1(76.84,98.17) v1(76.86,100.97) v1(78.74,111.51) v1(78.74,110.36) v1(78.74,109.22) v1(78.74,107.95) v1(78.74,106.68) v1(78.77,99.31) v1(78.77,98.17) v1(78.87,105.28) v1(78.87,103.89) v1(78.87,102.36) v1(78.99,100.97) v1(80.77,111.51) v1(80.77,110.36) v1(80.77,109.22) v1(80.77,107.95) v1(80.77,106.68) v1(80.9,105.28) v1(80.9,103.89) v1(80.9,102.36) v1(80.9,99.31) v1(80.9,98.17) v1(81.03,100.97) v1(82.68,111.51) v1(82.68,110.36) v1(82.68,109.22) v1(82.68,107.95) v1(82.68,106.68) v1(82.8,105.28) v1(82.8,103.89) v1(82.8,102.36) v1(82.93,100.97) v1(82.93,99.31) v1(82.93,98.17) v1(84.33,111.51) v1(84.33,110.36) v1(84.33,109.22) v1(84.33,107.95) v1(84.33,106.68) v1(84.46,105.28) v1(84.46,103.89) v1(84.46,102.36) v1(84.58,100.97) v1(84.84,99.31) v1(84.84,98.17) v1(86.11,111.51) v1(86.11,110.36) v1(86.11,109.22) v1(86.11,107.95) v1(86.11,106.68) v1(86.23,105.28) v1(86.23,103.89) v1(86.23,102.36) v1(86.36,100.97) v1(86.49,99.31) v1(86.49,98.17) v1(87.63,111.51) v1(87.63,110.36) v1(87.63,109.22) v1(87.63,107.95) v1(87.63,106.68) v1(87.76,105.28) v1(87.76,103.89) v1(87.76,102.36) v1(87.88,100.97) v1(88.26,99.31) v1(88.26,98.17) v1(89.79,101.09) v1(89.79,99.31) v1(89.79,98.17) v1(94.23,98.04) v1(94.74,101.09) v1(94.87,99.95) v1(94.87,98.81) v1(96.27,100.71) v1(96.27,99.44) v1(96.27,98.3)
M2+: length 36.4
  Top Layer w1.27: U6.4 U6.8
  Top Layer w2.54: CN2.1 79.96,59.57 M2+.1 73.48,53.09 U6.8
  vias: v1(62.99,60.84) v1(62.99,59.69) v1(62.99,58.55) v1(62.99,57.28) v1(62.99,56.01) v1(62.99,54.61) v1(62.99,53.22) v1(62.99,51.69) v1(63.12,50.34) v1(63.12,48.21) v1(64.26,50.34) v1(64.26,48.21) v1(65.12,60.84) v1(65.12,59.69) v1(65.12,58.55) v1(65.12,57.28) v1(65.12,56.01) v1(65.12,54.61) v1(65.12,53.22) v1(65.12,51.69) v1(65.41,50.34) v1(65.41,48.21) v1(66.68,50.34) v1(66.68,48.21) v1(67.16,60.84) v1(67.16,59.69) v1(67.16,58.55) v1(67.16,57.28) v1(67.16,56.01) v1(67.16,54.61) v1(67.16,53.22) v1(67.16,51.69) v1(67.94,50.34) v1(67.94,48.21) v1(69.06,60.84) v1(69.06,59.69) v1(69.06,58.55) v1(69.06,57.28) v1(69.06,56.01) v1(69.06,54.61) v1(69.06,53.22) v1(69.06,51.69) v1(69.34,50.34) v1(69.34,48.21) v1(70.71,60.84) v1(70.71,59.69) v1(70.71,58.55) v1(70.71,57.28) v1(70.71,56.01) v1(70.71,54.61) v1(70.71,53.22) v1(70.71,51.69) v1(70.74,50.34) v1(70.74,48.21) v1(72.26,50.34) v1(72.26,48.21) v1(72.49,60.84) v1(72.49,59.69) v1(72.49,58.55) v1(72.49,57.28) v1(72.49,56.01) v1(72.49,54.61) v1(72.49,53.22) v1(72.49,51.69) v1(74.01,60.84) v1(74.01,59.69) v1(74.01,58.55) v1(74.01,57.28) v1(74.01,56.01) v1(74.01,54.61) v1(74.01,53.22) v1(74.01,51.69) v1(74.04,50.34) v1(74.04,48.21) v1(75.18,50.34) v1(75.18,48.21) v1(76.02,60.83) v1(76.02,59.31) v1(76.02,57.91) v1(76.02,56.52) v1(76.02,55.25) v1(76.02,53.97) v1(76.02,52.83) v1(76.02,51.69) v1(76.33,50.34) v1(76.33,48.21) v1(77.6,50.34) v1(77.6,48.21) v1(78.16,60.83) v1(78.16,59.31) v1(78.16,57.91) v1(78.16,56.52) v1(78.16,55.25) v1(78.16,53.97) v1(78.16,52.83) v1(78.16,51.69) v1(78.87,50.34) v1(78.87,48.21) v1(80.26,50.34) v1(80.26,48.21) v1(80.9,60.88) v1(80.9,58.75) v1(80.9,57.2) v1(80.9,55.07) v1(82.04,60.88) v1(82.04,58.75) v1(82.04,57.2) v1(82.04,55.07) v1(83.19,60.88) v1(83.19,58.75) v1(83.19,57.2) v1(83.19,55.07) v1(84.46,60.88) v1(84.46,58.75) v1(84.46,57.2) v1(84.46,55.07) v1(85.72,60.88) v1(85.72,58.75) v1(85.72,57.2) v1(85.72,55.07) v1(87.12,60.88) v1(87.12,58.75) v1(87.12,57.2) v1(87.12,55.07) v1(88.52,60.88) v1(88.52,58.75) v1(88.52,57.2) v1(88.52,55.07) v1(90.04,60.88) v1(90.04,58.75) v1(90.04,57.2) v1(90.04,55.07) v1(92.07,57.2) v1(92.07,55.07) v1(93.6,55.07) v1(94.87,60.76) v1(94.87,58.62) v1(94.87,57.2) v1(96.39,60.76) v1(96.39,58.62) v1(96.39,57.2) v1(96.39,55.07)
M2-: length 36.4
  Top Layer w1.27: U7.4 U7.8
  Top Layer w2.54: U7.8 75.91,70.14 M2-.1 76.96,69.98 83.06,63.88 92.36,63.88 CN2.2
  vias: v1(62.93,74.77) v1(62.93,73.63) v1(62.93,72.49) v1(62.93,71.22) v1(62.93,69.95) v1(62.93,68.55) v1(62.93,67.15) v1(62.93,65.63) v1(63.07,64.01) v1(63.07,62.48) v1(65.06,74.77) v1(65.06,73.63) v1(65.06,72.49) v1(65.06,71.22) v1(65.06,69.95) v1(65.06,68.55) v1(65.06,67.15) v1(65.06,65.63) v1(65.2,64.01) v1(65.2,62.48) v1(67.09,74.77) v1(67.09,73.63) v1(67.09,72.49) v1(67.09,71.22) v1(67.09,69.95) v1(67.09,68.55) v1(67.09,67.15) v1(67.09,65.63) v1(67.23,64.01) v1(67.23,62.48) v1(69,74.77) v1(69,73.63) v1(69,72.49) v1(69,71.22) v1(69,69.95) v1(69,68.55) v1(69,67.15) v1(69,65.63) v1(69.14,64.01) v1(69.14,62.48) v1(70.65,74.77) v1(70.65,73.63) v1(70.65,72.49) v1(70.65,71.22) v1(70.65,69.95) v1(70.65,68.55) v1(70.65,67.15) v1(70.65,65.63) v1(70.79,64.01) v1(70.79,62.48) v1(72.43,74.77) v1(72.43,73.63) v1(72.43,72.49) v1(72.43,71.22) v1(72.43,69.95) v1(72.43,68.55) v1(72.43,67.15) v1(72.43,65.63) v1(72.57,64.01) v1(72.57,62.48) v1(73.95,74.77) v1(73.95,73.63) v1(73.95,72.49) v1(73.95,71.22) v1(73.95,69.95) v1(73.95,68.55) v1(73.95,67.15) v1(73.95,65.63) v1(74.09,64.01) v1(74.09,62.48) v1(75.78,74.77) v1(75.78,73.63) v1(75.78,72.49) v1(75.78,71.22) v1(75.78,69.95) v1(75.78,68.55) v1(75.78,67.15) v1(75.78,65.63) v1(75.9,64.01) v1(75.9,62.48) v1(77.92,74.77) v1(77.92,73.63) v1(77.92,72.49) v1(77.92,71.22) v1(77.92,69.95) v1(77.92,68.55) v1(77.92,67.15) v1(77.92,65.63) v1(78.03,64.01) v1(78.03,62.48) v1(79.95,74.77) v1(79.95,73.63) v1(79.95,72.49) v1(79.95,71.22) v1(79.95,69.95) v1(79.95,68.55) v1(79.95,67.15) v1(79.95,65.63) v1(80.06,64.01) v1(80.06,62.48) v1(81.85,74.77) v1(81.85,73.63) v1(81.85,72.49) v1(81.85,71.22) v1(81.85,69.95) v1(81.85,68.55) v1(81.85,67.15) v1(81.85,65.63) v1(81.97,64.01) v1(81.97,62.48) v1(83.5,74.77) v1(83.5,73.63) v1(83.5,72.49) v1(83.5,71.22) v1(83.5,69.95) v1(83.5,68.55) v1(83.5,67.15) v1(83.5,65.63) v1(83.62,64.01) v1(83.62,62.48) v1(85.28,74.77) v1(85.28,73.63) v1(85.28,72.49) v1(85.28,71.22) v1(85.28,69.95) v1(85.28,68.55) v1(85.28,67.15) v1(85.28,65.63) v1(85.39,64.01) v1(85.39,62.48) v1(86.81,74.77) v1(86.81,73.63) v1(86.81,72.49) v1(86.81,71.22) v1(86.81,69.95) v1(86.81,68.55) v1(86.81,67.15) v1(86.81,65.63) v1(86.92,64.01) v1(86.92,62.48) v1(88.65,65.28) v1(88.65,64.01) v1(88.65,62.48) v1(90.17,65.28) v1(90.17,64.01) v1(90.17,62.48) v1(94.74,65.28) v1(94.74,64.01) v1(94.74,62.48) v1(96.27,65.28) v1(96.27,64.01) v1(96.27,62.48)
M3+: length 34.8
  Top Layer w1.27: U9.4 U9.8
  Top Layer w2.54: U9.8 70.09,16.13 v1(75.87,16.13) ; M3+.1 77.25,16.03 79.25,18.04 CN3.1
  vias: v1(63.27,19.56) v1(63.27,18.41) v1(63.27,17.27) v1(63.27,16) v1(63.27,14.73) v1(63.27,13.34) v1(63.27,11.94) v1(63.27,10.41) v1(65.41,19.56) v1(65.41,18.41) v1(65.41,17.27) v1(65.41,16) v1(65.41,14.73) v1(65.41,13.34) v1(65.41,11.94) v1(65.41,10.41) v1(67.44,19.56) v1(67.44,18.41) v1(67.44,17.27) v1(67.44,16) v1(67.44,14.73) v1(67.44,13.34) v1(67.44,11.94) v1(67.44,10.41) v1(69.34,19.56) v1(69.34,18.41) v1(69.34,17.27) v1(69.34,16) v1(69.34,14.73) v1(69.34,13.34) v1(69.34,11.94) v1(69.34,10.41) v1(70.99,19.56) v1(70.99,18.41) v1(70.99,17.27) v1(70.99,16) v1(70.99,14.73) v1(70.99,13.34) v1(70.99,11.94) v1(70.99,10.41) v1(72.77,19.56) v1(72.77,18.41) v1(72.77,17.27) v1(72.77,16) v1(72.77,14.73) v1(72.77,13.34) v1(72.77,11.94) v1(72.77,10.41) v1(74.29,19.56) v1(74.29,18.41) v1(74.29,17.27) v1(74.29,16) v1(74.29,14.73) v1(74.29,13.34) v1(74.29,11.94) v1(74.29,10.41) v1(75.87,19.69) v1(75.87,18.54) v1(75.87,17.4) v1(75.87,14.86) v1(75.87,13.46) v1(75.87,12.06) v1(75.87,10.54) v1(77.39,19.69) v1(77.39,18.54) v1(77.39,17.4) v1(77.39,16.13) v1(77.39,14.86) v1(77.39,13.46) v1(77.39,12.06) v1(77.39,10.54) v1(78.87,19.69) v1(78.87,18.54) v1(78.87,17.4) v1(78.87,16.13) v1(78.87,14.86) v1(78.87,13.46) v1(78.87,12.06) v1(78.87,10.54) v1(80.39,19.69) v1(80.39,18.54) v1(80.39,17.4) v1(80.39,16.13) v1(80.39,14.86) v1(80.39,13.46) v1(80.39,12.06) v1(80.39,10.54) v1(81.28,19.18) v1(81.28,17.65) v1(82.42,19.18) v1(82.42,17.65) v1(83.57,19.18) v1(83.57,17.65) v1(84.84,19.18) v1(84.84,17.65) v1(86.11,19.18) v1(86.11,17.65) v1(86.11,16.64) v1(87.5,19.18) v1(87.5,17.65) v1(87.63,16.64) v1(88.9,19.18) v1(88.9,17.65) v1(88.9,16.64) v1(90.42,19.18) v1(90.42,17.65) v1(90.42,16.64) v1(94.74,18.92) v1(94.74,17.4) v1(96.14,19.05) v1(96.14,17.53)
M3-: length 40.7
  Top Layer w1.27: U10.4 U10.8
  Top Layer w2.54: 75.85,31.75 75.65,31.95 U10.8 ; 75.85,31.75 v1(77.9,31.75) v1(79.93,31.75) v1(81.84,31.75) 82.17,31.75 83.82,30.1 v1(83.82,25.97) 83.82,25.27 87.09,22 CN3.2 ; 75.85,31.75 v1(75.77,31.75)
  vias: v1(63.02,36.45) v1(63.02,35.31) v1(63.02,34.16) v1(63.02,32.89) v1(63.02,31.62) v1(63.02,30.23) v1(63.02,28.83) v1(63.02,27.31) v1(65.15,36.45) v1(65.15,35.31) v1(65.15,34.16) v1(65.15,32.89) v1(65.15,31.62) v1(65.15,30.23) v1(65.15,28.83) v1(65.15,27.31) v1(67.18,36.45) v1(67.18,35.31) v1(67.18,34.16) v1(67.18,32.89) v1(67.18,31.62) v1(67.18,30.23) v1(67.18,28.83) v1(67.18,27.31) v1(69.09,36.45) v1(69.09,35.31) v1(69.09,34.16) v1(69.09,32.89) v1(69.09,31.62) v1(69.09,30.23) v1(69.09,28.83) v1(69.09,27.31) v1(70.74,36.45) v1(70.74,35.31) v1(70.74,34.16) v1(70.74,32.89) v1(70.74,31.62) v1(70.74,30.23) v1(70.74,28.83) v1(70.74,27.31) v1(72.52,36.45) v1(72.52,35.31) v1(72.52,34.16) v1(72.52,32.89) v1(72.52,31.62) v1(72.52,30.23) v1(72.52,28.83) v1(72.52,27.31) v1(74.04,36.45) v1(74.04,35.31) v1(74.04,34.16) v1(74.04,32.89) v1(74.04,31.62) v1(74.04,30.23) v1(74.04,28.83) v1(74.04,27.31) v1(75.77,36.58) v1(75.77,35.43) v1(75.77,34.29) v1(75.77,33.02) v1(75.77,30.35) v1(75.77,28.96) v1(75.77,27.43) v1(77.9,36.58) v1(77.9,35.43) v1(77.9,34.29) v1(77.9,33.02) v1(77.9,30.35) v1(77.9,28.96) v1(77.9,27.43) v1(79.93,36.58) v1(79.93,35.43) v1(79.93,34.29) v1(79.93,33.02) v1(79.93,30.35) v1(79.93,28.96) v1(79.93,27.43) v1(81.84,36.58) v1(81.84,35.43) v1(81.84,34.29) v1(81.84,33.02) v1(81.84,30.35) v1(81.84,28.96) v1(81.84,27.43) v1(82.04,25.97) v1(82.04,24.57) v1(82.04,23.05) v1(82.11,21.97) v1(82.11,20.45) v1(83.49,36.58) v1(83.49,35.43) v1(83.49,34.29) v1(83.49,33.02) v1(83.49,31.75) v1(83.49,30.35) v1(83.49,28.96) v1(83.49,27.43) v1(83.82,24.57) v1(83.82,23.05) v1(83.88,21.97) v1(83.88,20.45) v1(85.27,36.58) v1(85.27,35.43) v1(85.27,34.29) v1(85.27,33.02) v1(85.27,31.75) v1(85.27,30.35) v1(85.27,28.96) v1(85.27,27.43) v1(85.34,25.97) v1(85.34,24.57) v1(85.34,23.05) v1(85.41,21.97) v1(85.41,20.57) v1(86.74,25.97) v1(86.74,24.57) v1(86.74,23.43) v1(86.74,22.03) v1(86.74,20.51) v1(86.79,36.58) v1(86.79,35.43) v1(86.79,34.29) v1(86.79,33.02) v1(86.79,31.75) v1(86.79,30.35) v1(86.79,28.96) v1(86.79,27.43) v1(88.65,23.56) v1(88.65,22.16) v1(88.65,20.64) v1(90.17,23.56) v1(90.17,22.16) v1(90.17,20.64) v1(94.74,23.56) v1(94.74,22.16) v1(94.74,20.64) v1(96.14,23.56) v1(96.14,22.16) v1(96.14,20.64)
POT/HALLB1: length 64.8
  Inner2 w0.762: CN1.4 90.68,109.42 90.68,112.52 89.15,114.05 78.36,114.05 71.37,121.03 71.37,137.16 69.72,138.81 55.12,138.81 53.81,140.12 J1.13
POT/HALLB2: length 102.5
  Inner2 w0.762: CN2.4 90.6,71.45 89.15,72.9 89.15,74.42 86.36,77.22 61.34,77.22 56.77,81.79 56.77,109.98 55.37,111.38 55.37,117.86 v1(57.53,120.02)
  Bottom Layer w0.762: J1.15 56.35,121.2 v1(57.53,120.02)
POT/HALLB3: length 151.2
  Inner2 w0.762: v1(86.74,120.78) 87.78,119.74 94.57,119.74 98.15,116.16 98.15,76.94 v1(97.03,75.82) ; CN3.4 95.07,29.92 95.88,30.73 95.88,49.91 v1(96.52,50.55)
  Bottom Layer w0.762: v1(97.03,75.82) 98.04,74.8 98.04,52.07 v1(96.52,50.55) ; v1(86.74,120.78) 86.41,120.45 61.6,120.45 59.82,122.23 59.82,140.28 J1.17
PWM1_L: length 89.4
  Top Layer w0.762: R4.1 PWM1_L.1 13.25,118.87 v1(15.49,118.87) ; R19.2 29.89,99.61 31.2,100.93 U2.6 31.2,104.69 26.29,109.6 v1(26.29,110.36)
  Inner2 w0.762: v1(15.49,118.87) 15.49,112.9 18.03,110.36 v1(26.29,110.36)
  Bottom Layer w0.762: v1(15.49,118.87) 15.49,139.19 20.04,143.74 J1.2
PWM1_L_BUF: length 29.6
  Top Layer w0.762: U4.2 55.55,109.42 v1(55.12,109.86) ; U2.14 32.47,110.91 v1(33.4,109.98)
  Bottom Layer w0.762: v1(55.12,109.86) 54.36,109.09 34.29,109.09 v1(33.4,109.98)
PWM1_R: length 82.4
  Top Layer w0.762: R17.2 19.86,100.51 20.83,101.47 25.65,101.47 26.12,101.94 U2.2 26.12,105.83 23.75,108.2 v1(17.02,108.2) ; v1(16.89,123.19) 13.42,123.19 PWM1_R.1 R3.1
  Bottom Layer w0.762: v1(17.02,108.2) 17.02,123.06 v1(16.89,123.19) 16.89,138.56 19.54,141.2 J1.1
PWM1_R_BUF: length 45.2
  Top Layer w0.762: U2.18 27.39,109.89 30.1,107.19 34.54,107.19 35.69,106.05 v1(35.69,105.79) ; U3.2 56.01,92.2 51.69,96.52 v1(47.5,96.52)
  Bottom Layer w0.762: v1(47.5,96.52) 39.37,96.52 35.69,100.2 v1(35.69,105.79)
PWM2_L: length 137.1
  Top Layer w0.762: v1(13.72,100.58) 13.42,100.88 PWM2_L.1 9,100.88 R6.1 ; v1(23.5,74.8) 23.5,71.25 25.27,69.47 29.08,69.47 31.2,67.35 U5.6 31.2,60.92 29.46,59.17 R28.2
  Inner2 w0.762: v1(13.72,100.58) 21.21,100.58 23.5,98.3 v1(23.5,74.8)
  Bottom Layer w0.762: v1(13.72,100.58) 13.72,139.57 19.27,145.12 40.35,145.12 41.11,144.36 J1.4
PWM2_L_BUF: length 29.5
  Top Layer w0.762: U5.14 32.47,71.79 33.66,70.61 v1(35.31,70.61) ; v1(54.29,72.58) 54.39,72.68 U7.2
  Bottom Layer w0.762: v1(35.31,70.61) 52.32,70.61 v1(54.29,72.58)
PWM2_R: length 122.2
  Top Layer w0.762: R5.1 12.42,104.14 PWM2_R.1 12.59,104.27 v1(18.16,104.27) 17.53,103.63 v1(17.53,99.31) ; v1(22.61,70.36) 26.12,66.84 U5.2 26.12,62.7 25.27,61.85 20.95,61.85 19.86,60.76 R26.2
  Inner2 w0.762: v1(22.61,70.36) 20.57,72.39 20.57,97.41 18.67,99.31 v1(17.53,99.31)
  Bottom Layer w0.762: v1(18.16,104.27) 18.16,137.92 19.43,139.19 39.5,139.19 41.11,140.81 J1.3
PWM2_R_BUF: length 46.4
  Top Layer w0.762: v1(27.94,70.87) 27.39,71.41 U5.18 ; v1(53.85,56.13) 54.36,55.63 U6.2
  Bottom Layer w0.762: v1(27.94,70.87) 30.35,68.45 52.2,68.45 53.85,66.8 v1(53.85,56.13)
PWM3_L: length 180.5
  Top Layer w0.762: R37.2 30.34,21.07 31.2,21.93 U8.6 31.2,28.49 v1(30.42,29.27) ; R9.1 9.15,82.42 v1(11.05,82.42) 12.49,82.42 PWM3_L.1
  Inner2 w0.762: v1(30.42,29.27) 24.19,29.27 19.71,33.76 19.71,78.72 16,82.42 v1(11.05,82.42)
  Bottom Layer w0.762: v1(11.05,82.42) 11.81,83.19 11.81,139.32 18.67,146.18 41.22,146.18 J1.6
PWM3_L_BUF: length 31
  Top Layer w0.762: v1(53.59,34.29) 53.8,34.49 U10.2 ; U8.14 32.47,36.79 v1(32.51,36.83)
  Bottom Layer w0.762: v1(32.51,36.83) 32.51,35.56 33.78,34.29 v1(53.59,34.29)
PWM3_R: length 163.7
  Top Layer w0.762: v1(19.3,86.23) 19.26,86.28 PWM3_R.1 R7.1 ; v1(26.12,27.81) U8.2 26.12,23.46 25.65,22.99 20.7,22.99 19.86,22.15 R35.2
  Inner2 w0.762: v1(26.12,27.81) 24.43,27.81 18.85,33.4 18.85,77.93 v1(16.76,80.01)
  Bottom Layer w0.762: J1.5 43.65,140.17 41.53,138.05 21.34,138.05 19.3,136.02 v1(19.3,86.23) 19.3,82.55 v1(16.76,80.01)
PWM3_R_BUF: length 45.3
  Top Layer w0.762: U8.18 27.39,31.97 v1(27.05,31.62) ; U9.2 54.04,17.84 v1(52.83,19.05)
  Bottom Layer w0.762: v1(27.05,31.62) 27.05,23.24 31.24,19.05 v1(52.83,19.05)
$1N5026: length 7.6
  Top Layer w0.762: PWM_R1.2 7.32,123.6 R3.2
$1N6475: length 7.6
  Top Layer w0.762: R4.2 7.26,119.85 PWM_L1.1
$1N6556: length 7
  Top Layer w0.762: R5.2 6.69,104.89 PWM_R2.2
$1N6637: length 7.1
  Top Layer w0.762: R7.2 6.81,87.03 PWM_R3.2
$1N6809: length 6.9
  Top Layer w0.762: R6.2 6.63,101.64 PWM_L2.1
$1N6893: length 7.1
  Top Layer w0.762: PWM_L3.1 6.75,83.15 R9.2
$1N7000: length 7.7
  Top Layer w0.762: EN_1.2 7.17,115.9 R10.2
$1N7103: length 7.3
  Top Layer w0.762: R11.2 6.79,98.44 EN_2.2
$1N7182: length 7.2
  Top Layer w0.762: EN_3.2 6.66,78.93 R12.2
$1N7339: length 7.7
  Top Layer w0.762: R8.2 7.17,135.18 5V_LED1.2
$1N7791: length 2.5
  Top Layer w0.762: C1.2 88.18,135.15 U1.1
$1N7985: length 16.8
  Top Layer w0.508: U1.5 91.91,134.2 91.44,133.73 v1(91.44,132.21)
  Top Layer w0.762: R1.1 89.41,122.55 v1(89.41,121.16)
  Inner2 w0.762: v1(89.41,121.16) 90.3,121.16 91.44,122.3 v1(91.44,132.21)
$1N7989: length 9
  Top Layer w0.508: R1.2 86.66,123.78 R2.2 86.97,124.86 D1.1 90.37,125.47 Q1.4
$1N23426: length 7.7
  Top Layer w0.762: R40.2 7.22,131.56 24V_LED2.2
$2N1023: length 12.3
  Top Layer w0.762: R13.1 51.57,94.73 53.72,92.58 53.72,90.93 56.26,88.39 U3.5
$2N1304: length 9.6
  Top Layer w0.762: R15.2 51.59,107.67 53.65,105.61 U4.5
$2N2113: length 12.3
  Top Layer w0.762: R16.2 51.19,93.21 52.71,91.69 52.71,89.92 55.5,87.12 U3.6
$2N2143: length 9.5
  Top Layer w0.762: 59.01,104.34 53.26,104.34 51.46,106.14 R14.2
$2N6070: length 4
  Top Layer w0.762: R21.2 42.94,107.65 R20.1
$3N5041: length 10.2
  Top Layer w0.762: U6.5 56.01,51.82 52.39,55.43 R22.1
$3N5057: length 9.1
  Top Layer w0.762: U7.5 51.12,68.87 R24.2
$3N5085: length 10.2
  Top Layer w0.762: U6.6 55.88,50.55 52.44,53.99 R25.2
$3N5086: length 9.2
  Top Layer w0.762: R23.2 51.45,67.6 U7.6
$3N5119: length 3.9
  Top Layer w0.762: R30.2 42.94,67.44 R29.1
$4N5103: length 10
  Top Layer w0.762: R31.1 51.88,16.96 54.8,14.03 U9.5
$4N5119: length 8.9
  Top Layer w0.762: R33.2 50.69,30.68 U10.5
$4N5147: length 9.9
  Top Layer w0.762: R34.2 50.74,15.55 53.53,12.76 U9.6
$4N5148: length 9
  Top Layer w0.762: U10.6 51.64,29.41 51.03,28.8 R32.2
$4N5181: length 4
  Top Layer w0.762: R39.2 42.55,33.39 R38.1

## Copper pours and planes (outline as drawn; the poured copper is in the pictures)
+5V on Inner2: 100,0 76.66,0 76.66,104.5 77.21,105.05 100,105.05
GND on Top Layer: 0,0 55.63,0 55.68,-0.05 55.68,112.72 100,112.72 100,150.11 0,150.11
GND on Bottom Layer: 0,0 55.63,0 55.68,-0.05 55.68,112.72 100,112.72 100,150.11 0,150.11
GND on Inner1: 0,150.11 100.08,150.11 100.08,0 0,0
VBAT on Inner2: 0,0 40.51,0 40.64,-0.13 40.64,119.48 100,119.48 100,150.11 0,150.11
VBAT_M1 on Inner2: 41.15,113.92 73.99,113.92 73.99,80.34 41.15,80.34
VBAT_M2 on Inner2: 41.15,79.76 73.99,79.76 73.99,43.46 41.15,43.46
VBAT_M3 on Inner2: 41.15,42.62 73.94,42.62 73.94,0 41.15,0
M1+ on Top Layer: 61.59,97.32 61.59,90.42 56.13,90.42 56.13,89.03 61.59,89.03 61.59,84.33 80.58,84.33 80.58,91.54 96.77,91.54 96.77,97.32
M1+ on Bottom Layer: 61.59,97.32 61.59,90.42 56.13,90.42 56.13,89.03 61.59,89.03 61.59,84.33 80.58,84.33 80.58,91.54 96.77,91.54 96.77,97.32
M1- on Top Layer: 56.01,106.3 56.01,107.57 61.47,107.57 61.47,112.01 88.04,112.01 88.04,101.66 96.71,101.66 96.71,97.73 61.47,97.73 61.47,106.3
M1- on Bottom Layer: 56.01,106.3 56.01,107.57 61.47,107.57 61.47,112.01 88.04,112.01 88.04,101.66 96.71,101.66 96.71,97.73 61.92,97.73 61.47,97.28 61.47,106.3
M2+ on Top Layer: 62.49,52.32 62.48,52.32 56.26,52.32 56.26,53.85 62.49,53.85 62.49,61.47 96.96,61.47 96.96,54.48 80.76,54.48 80.76,46.96 62.49,47.01
M2+ on Bottom Layer: 62.37,52.32 62.36,52.32 56.14,52.32 56.14,53.85 62.37,53.85 62.37,61.47 96.97,61.47 96.97,54.48 80.64,54.48 80.64,46.96 62.37,47.01
M2- on Top Layer: 62.36,65.06 62.36,69.41 56.13,69.41 56.13,70.87 62.36,70.87 62.36,75.22 87.85,75.22 87.88,75.18 87.88,65.72 96.84,65.72 96.84,61.72 62.36,61.72 62.36,65.06
M2- on Bottom Layer: 62.49,65.06 62.49,69.41 56.26,69.41 56.26,70.87 62.49,70.87 62.49,75.22 87.98,75.22 88.01,75.18 88.01,65.72 96.71,65.72 96.71,61.72 62.48,61.72 62.48,65.06
M3+ on Top Layer: 62.49,10.15 62.49,10.16 62.49,14.57 56.13,14.57 56.13,16.1 62.49,16.1 62.49,19.82 96.71,19.82 96.71,16.22 81.15,16.22 81.15,10.15
M3+ on Bottom Layer: 62.62,10.15 62.61,10.16 62.61,14.57 56.26,14.57 56.26,16.1 62.61,16.1 62.61,19.82 96.84,19.82 96.84,16.22 81.28,16.22 81.28,10.15
M3- on Top Layer: 62.49,31.18 56.01,31.18 56.01,32.63 62.49,32.63 62.49,37.03 88.04,37.03 88.04,24.16 96.55,24.16 96.65,24.26 96.65,20.06 81.69,20.06 81.69,26.85 62.49,26.85
M3- on Bottom Layer: 62.57,31.19 56.09,31.19 56.09,32.64 62.57,32.64 62.57,37.03 88.12,37.03 88.12,24.17 96.64,24.17 96.73,24.26 96.73,20.06 81.78,20.06 81.78,26.85 62.57,26.85

Small or netless copper shapes (teardrops, artwork), in the pictures only: 213 on Top Layer, 17 on Bottom Layer, 14 on Inner2

## Text on the board
Top Silkscreen Layer: PWM1_L | PWM1_R | PWM2_L | PWM2_R | PWM3_L | PWM3_R | IS1 | EN1 | IS2 | EN2 | IS3 | EN3 | HALLLB1 | POT/HALLB1 | HALLLB2 | POT/HALLB2 | HALLLB3 | POT/HALLB3 | GND | 5V | HALLA1 | HALLA2 | HALLA3 | M3- | M3+ | M2+ | M2- | M1- | M1+ | MOTOR 3 | MOTOR 2 | MOTOR 1 | POWER | Krabby / Uno / v0.2
